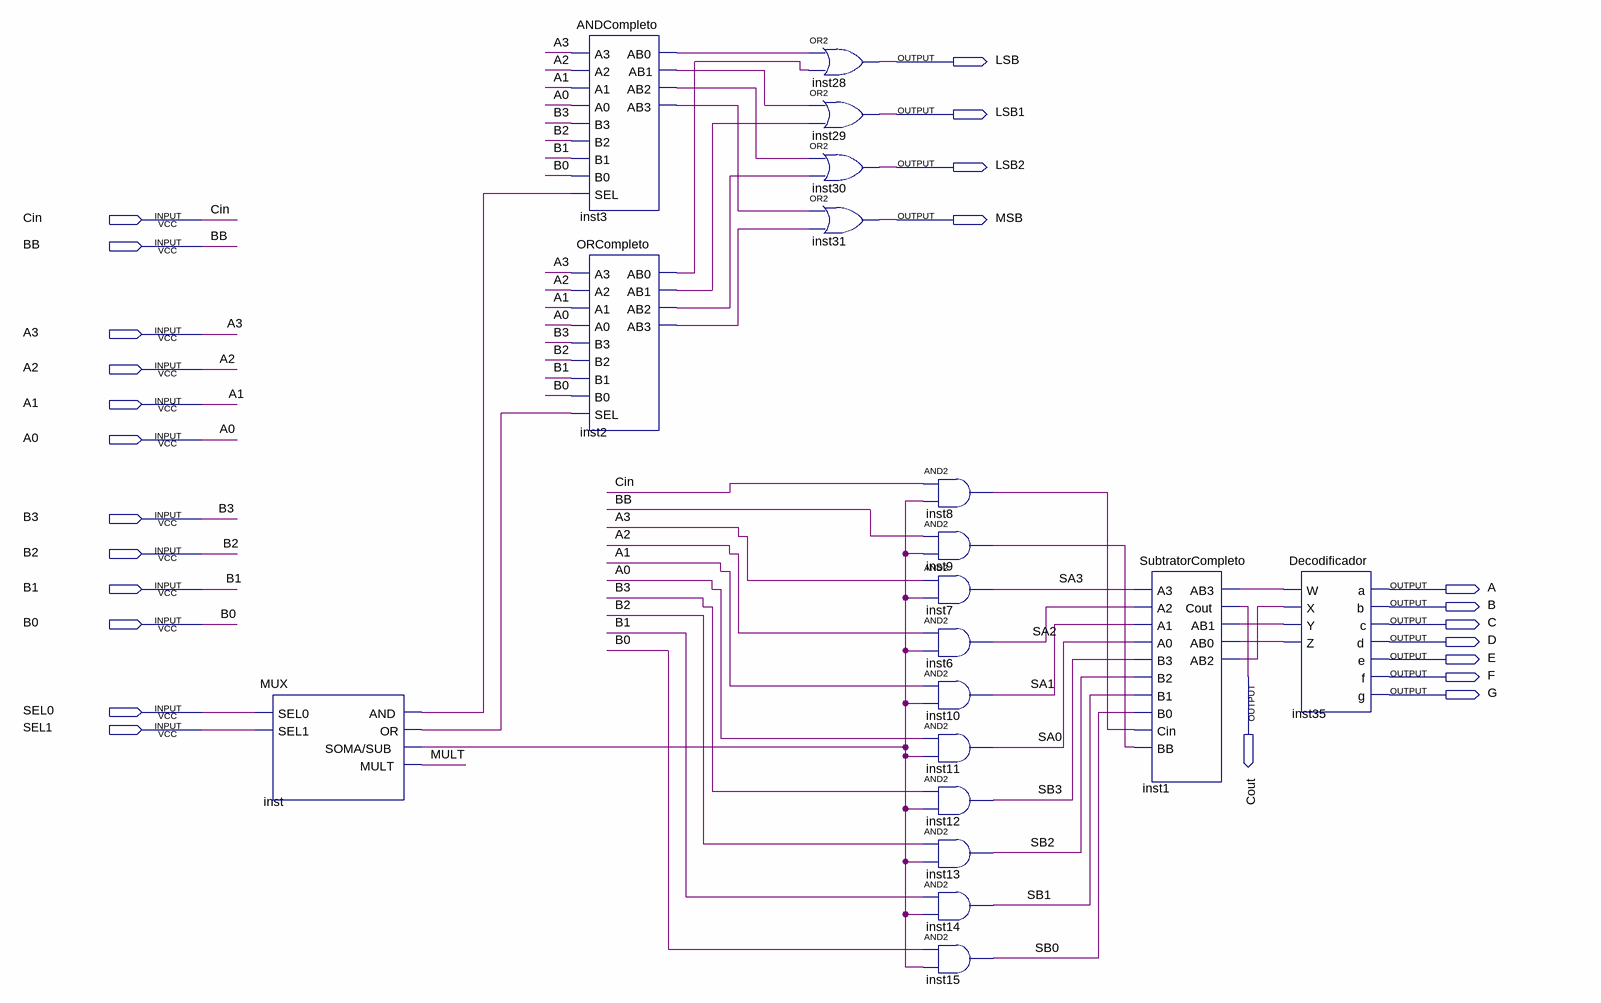
[diagram p0: schematic sheet]
// Quartus schematic ULA.bdf as structural Verilog: 19 symbols, 24 pins
module ULA (
  input  Cin,
  input  BB,
  input  A3,
  input  A2,
  input  A1,
  input  A0,
  input  B3,
  input  B2,
  input  B1,
  input  B0,
  input  SEL0,
  input  SEL1,
  output LSB,
  output LSB1,
  output LSB2,
  output MSB,
  output A,
  output B,
  output C,
  output D,
  output E,
  output Cout,
  output F,
  output G
);

  wire inst1_ab0, inst1_ab1, inst1_ab2, inst1_ab3, inst2_ab0, inst2_ab1, inst2_ab2, inst2_ab3, inst3_ab0,
       inst3_ab1, inst3_ab2, inst3_ab3, inst8_out, inst9_out, inst_and, inst_or, inst_soma_sub, MULT, SA0,
       SA1, SA2, SA3, SB0, SB1, SB2, SB3;

  MUX inst (.SEL0(SEL0), .SEL1(SEL1), .AND(inst_and), .OR(inst_or), .\SOMA/SUB (inst_soma_sub), .MULT(MULT));
  ANDCompleto inst3 (
    .A3(A3), .A2(A2), .A1(A1), .A0(A0), .B3(B3), .B2(B2), .B1(B1), .B0(B0), .SEL(inst_and), .AB0(inst3_ab0),
    .AB1(inst3_ab1), .AB2(inst3_ab2), .AB3(inst3_ab3));
  ORCompleto inst2 (
    .A3(A3), .A2(A2), .A1(A1), .A0(A0), .B3(B3), .B2(B2), .B1(B1), .B0(B0), .SEL(inst_or), .AB0(inst2_ab0),
    .AB1(inst2_ab1), .AB2(inst2_ab2), .AB3(inst2_ab3));
  or inst28 (LSB, inst3_ab0, inst2_ab0);
  or inst29 (LSB1, inst3_ab1, inst2_ab1);
  or inst30 (LSB2, inst3_ab2, inst2_ab2);
  or inst31 (MSB, inst3_ab3, inst2_ab3);
  and inst8 (inst8_out, Cin, inst_soma_sub);
  and inst9 (inst9_out, BB, inst_soma_sub);
  and inst7 (SA3, A3, inst_soma_sub);
  and inst6 (SA2, A2, inst_soma_sub);
  and inst10 (SA1, A1, inst_soma_sub);
  and inst11 (SA0, A0, inst_soma_sub);
  and inst12 (SB3, B3, inst_soma_sub);
  and inst13 (SB2, B2, inst_soma_sub);
  and inst14 (SB1, B1, inst_soma_sub);
  and inst15 (SB0, B0, inst_soma_sub);
  SubtratorCompleto inst1 (
    .A3(SA3), .A2(SA2), .A1(SA1), .A0(SA0), .B3(SB3), .B2(SB2), .B1(SB1), .B0(SB0), .Cin(inst8_out),
    .BB(inst9_out), .AB3(inst1_ab3), .Cout(Cout), .AB1(inst1_ab1), .AB0(inst1_ab0), .AB2(inst1_ab2));
  Decodificador inst35 (
    .W(inst1_ab3), .X(inst1_ab2), .Y(inst1_ab1), .Z(inst1_ab0), .a(A), .b(B), .c(C), .d(D), .e(E), .f(F),
    .g(G));
endmodule
